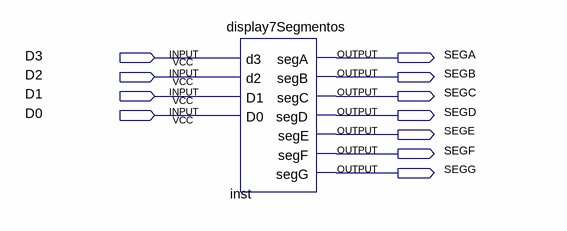
[diagram p0: schematic sheet]
// Quartus schematic broco.bdf as structural Verilog: 1 symbols, 11 pins
module broco (
  input  D3,
  input  D2,
  input  D1,
  input  D0,
  output SEGA,
  output SEGB,
  output SEGC,
  output SEGD,
  output SEGE,
  output SEGF,
  output SEGG
);

  display7Segmentos inst (
    .d3(D3), .d2(D2), .D1(D1), .D0(D0), .segA(SEGA), .segB(SEGB), .segC(SEGC), .segD(SEGD), .segE(SEGE),
    .segF(SEGF), .segG(SEGG));
endmodule
